# EAGLE design debug_board (EAGLE 7.7.0)
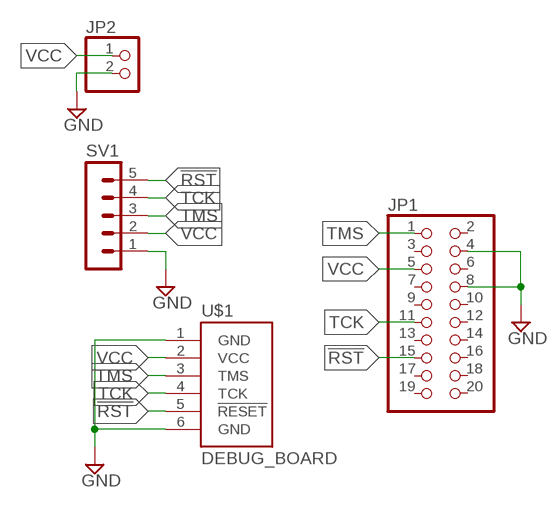
[diagram p0: schematic, sheet 1]

## Parts
JP1  PINHD-2X10  [2X10]
JP2  PINHD-1X2  [1X02]
SV1  MA05-1  [MA05-1]
U$1  DEBUG_BOARD  [DEBUG_BOARD]

## Nets
!RST: JP1.15 SV1.5 U$1.5(!RESET)
GND: JP1.4 JP1.8 JP2.2 SV1.1 U$1.1(GND) U$1.6(GND)
TCK: JP1.11 SV1.4 U$1.4(TCK)
TMS: JP1.1 SV1.3 U$1.3(TMS)
VCC: JP1.5 JP2.1 SV1.2 U$1.2(VCC)
Unconnected: JP1.2 JP1.3 JP1.6 JP1.7 JP1.9 JP1.10 JP1.12 JP1.13 JP1.14 JP1.16 JP1.17 JP1.18 JP1.19 JP1.20

## Library data of the parts
JP1 = pinhead:PINHD-2X10: PIN HEADER
JP2 = pinhead:PINHD-1X2: PIN HEADER
SV1 = con-lstb:MA05-1: PIN HEADER; OC_FARNELL: unknown; OC_NEWARK: unknown
U$1 = mine:DEBUG_BOARD

## Board
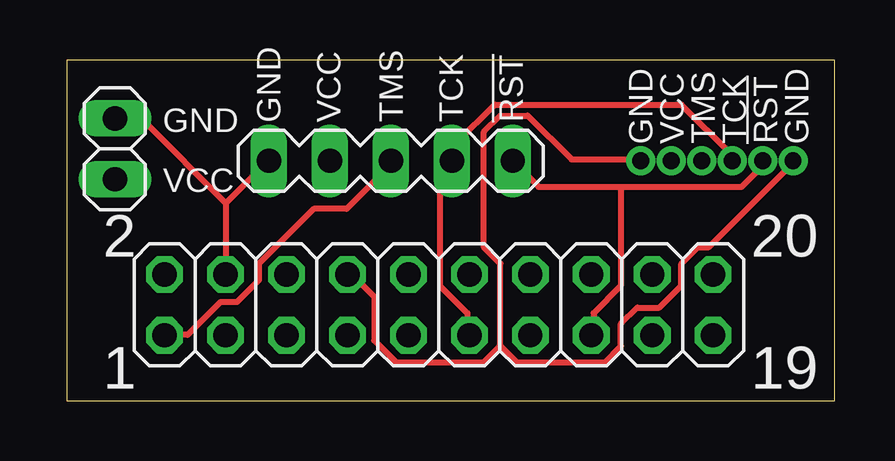
[diagram p1: board, top side]
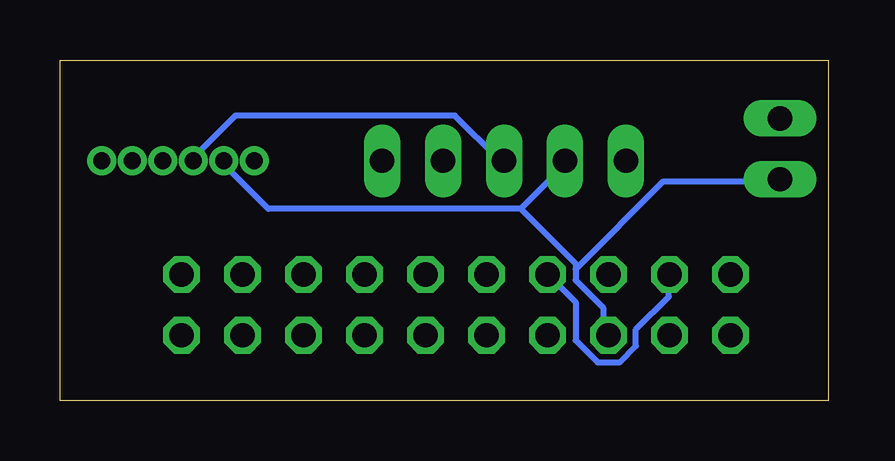
[diagram p2: board, bottom side, seen from below]

Size 32 x 14.2 mm. Coordinates in mm from the lower left corner, seen from the top.
Outline: 0,0 32,0 32,14.2 0,14.2 0,0
Copper layers (1*16): Top 0.035mm / dielectric 1.5mm / Bottom 0.035mm
Design rules "default": minimum track width 10mil, minimum drill 24mil, track to track 8mil, track to pad 8mil, pad to pad 8mil, via to via 8mil, smd to smd 8mil, copper to edge 40mil, drill to drill 8mil, minimum pad ring 10mil, minimum via ring 8mil, stop-mask expansion 4mil, vias tented up to drill 0mil, thermal gap 10mil

### Footprints (pad centres in the part's own frame; a part is rotated, then mirrored left to right if it is on the bottom)
2X10 = drill 1.016 octagon: 1 -11.43,-1.27; 2 -11.43,1.27; 3 -8.89,-1.27; 4 -8.89,1.27; 5 -6.35,-1.27; 6 -6.35,1.27; 7 -3.81,-1.27; 8 -3.81,1.27; 9 -1.27,-1.27; 10 -1.27,1.27; 11 1.27,-1.27; 12 1.27,1.27; 13 3.81,-1.27; 14 3.81,1.27; 15 6.35,-1.27; 16 6.35,1.27; 17 8.89,-1.27; 18 8.89,1.27; 19 11.43,-1.27; 20 11.43,1.27
1X02 = drill 1.016 long: 1 -1.27,0; 2 1.27,0
MA05-1 = drill 1.016 long: 1 -5.08,0; 2 -2.54,0; 3 0,0; 4 2.54,0; 5 5.08,0
DEBUG_BOARD = drill 0.7: 1 0,2.591; 2 0,1.321; 3 0,0.051; 4 0,-1.219; 5 0,-2.489; 6 0,-3.759

### Placement (x,y rotation side)
JP1  15.5,4 0 top
JP2  2,10.5 90 top
SV1  13.5,10 0 top
U$1  26.5,10 90 top

### Tracks (layer width: path | path; a pad name or v marks a point on that pad's centre or on a via)
!RST
  Top 0.254: 23.09,8.91 19.66,8.91 18.75,9.83 SV1.5 | 23.09,8.91 28.12,8.91 28.8,9.6 28.8,9.83 U$1.5 | 23.09,8.91 23.09,4.8 21.95,3.66 21.95,2.74 JP1.15
GND
  Top 0.254: 6.63,8.23 6.63,5.49 JP1.4 | 6.63,8.23 8.23,9.83 SV1.1 | 6.63,8.23 3.2,11.66 2.06,11.66 JP2.2 | 18.06,2.29 18.06,5.71 17.37,6.4 17.37,11.2 18.06,11.89 19.2,11.89 21.03,10.06 23.77,10.06 U$1.1 | 18.06,2.29 17.37,1.6 13.72,1.6 12.8,2.52 12.8,4.34 11.89,5.26 JP1.8 | 18.06,2.29 18.75,1.6 22.4,1.6 23.09,2.29 23.09,3.2 23.77,3.89 24.69,3.89 25.6,4.8 25.6,5.71 26.29,6.4 26.75,6.4 30.18,9.83 U$1.6
  Bottom 0.254: JP1.4 6.63,5.26 6.63,4.34 8,2.97 8,2.29 8.69,1.6 9.6,1.6 10.52,2.52 10.52,4.12 11.66,5.26 JP1.8
TCK
  Top 0.254: U$1.4 27.66,10.06 27.66,10.29 25.6,12.34 17.83,12.34 16.23,10.74 16.23,10.06 SV1.4 16,9.83 15.54,9.37 15.54,4.8 16.69,3.66 16.69,2.74 JP1.11
TMS
  Top 0.254: JP1.1 4.12,2.74 5.03,2.74 6.4,4.12 7.09,4.12 8,5.03 8,5.71 10.29,8 11.66,8 13.49,9.83 SV1.3
  Bottom 0.254: U$1.3 26.29,10.06 26.29,10.29 24.69,11.89 15.54,11.89 13.72,10.06 SV1.3
VCC
  Bottom 0.254: 12.8,8 23.32,8 25.15,9.83 U$1.2 | 12.8,8 10.97,9.83 SV1.2 | 10.52,5.49 10.52,5.71 12.8,8 | 10.52,5.49 10.52,5.03 9.37,3.89 9.37,2.74 JP1.5 | 10.52,5.49 6.86,9.14 2.06,9.14 JP2.1

### Text on the board
tPlace: GND | GND | VCC | TMS | TCK | !RST | GND | VCC | TMS | TCK | !RST | GND | VCC | 2 | 20 | 1 | 19